# Altium project CarteAquisition.PrjPcb
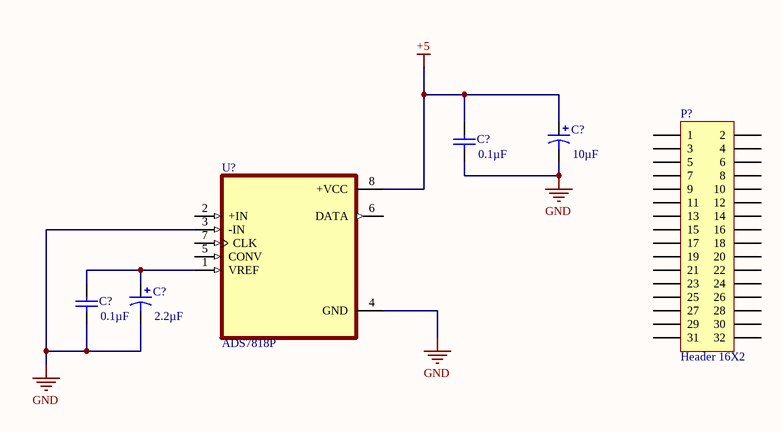
[diagram p0: Schematic.SchDoc]
1 sheet, 6 parts. Net scope: global (net labels, ports and power ports of the same name join across sheets).
Board file: PCB.PcbDoc

## Sheet Schematic.SchDoc
size A

### Parts
C1  value 10µF  [RB7.6-15]  (hidden comment: Cap Pol1)
C2  value 0.1µF  [RAD-0.3]  (hidden comment: Cap)
C3  value 2.2µF  [RB7.6-15]  (hidden comment: Cap Pol1)
C4  value 0.1µF  [RAD-0.3]  (hidden comment: Cap)
P1  Header 16X2  [HDR2X16]
U1  ADS7818P  [DIP794W45P254L959H508Q8]

### Nets
+5: C1.1 C2.2 U1.8(+VCC)
GND: C1.2 C2.1 C3.2 C4.1 U1.3(-IN) U1.4(GND)
NetC3_1: C3.1 C4.2 U1.1(VREF)

Not connected (* = marked no-connect by the designer): P1 1 2 3 4 5 6 7 8 9 10 11 12 13 14 15 16 17 18 19 20 21 22 23 24 25 26 27 28 29 30 31 32; U1 2(+IN) 5(CONV) 6(DATA) 7(CLK)

### Library data of the parts
C1 C3 = Cap Pol1: Polarized Capacitor (Radial); Published: 8-Jun-2000; LatestRevisionDate: 17-Jul-2002; LatestRevisionNote: Re-released for DXP Platform.; PackageReference: RB7.6-15; Publisher: Altium Limited; PackageDescription: Polarized Capacitor (Radial); 2 Leads
C2 C4 = Cap: Capacitor; Published: 8-Jun-2000; LatestRevisionDate: 17-Jul-2002; LatestRevisionNote: Re-released for DXP Platform.; PackageReference: RAD-0.3; Publisher: Altium Limited; PackageDescription: Radial Cap, Thru-Hole; 2 Leads; 0.3 in Pin Spacing
P1 = Header 16X2: Header, 16-Pin, Dual row; LatestRevisionDate: 17-Jul-2002; LatestRevisionNote: Re-released for DXP Platform.; Publisher: Altium Limited
U? = ADS7818P: Package: None; Price: None; Value: *; MP: ADS7818P; Availability: Unavailable